# Altium schematic sheet peripheral.SchDoc
size A3; SheetNumber: 2; SheetTotal: 2
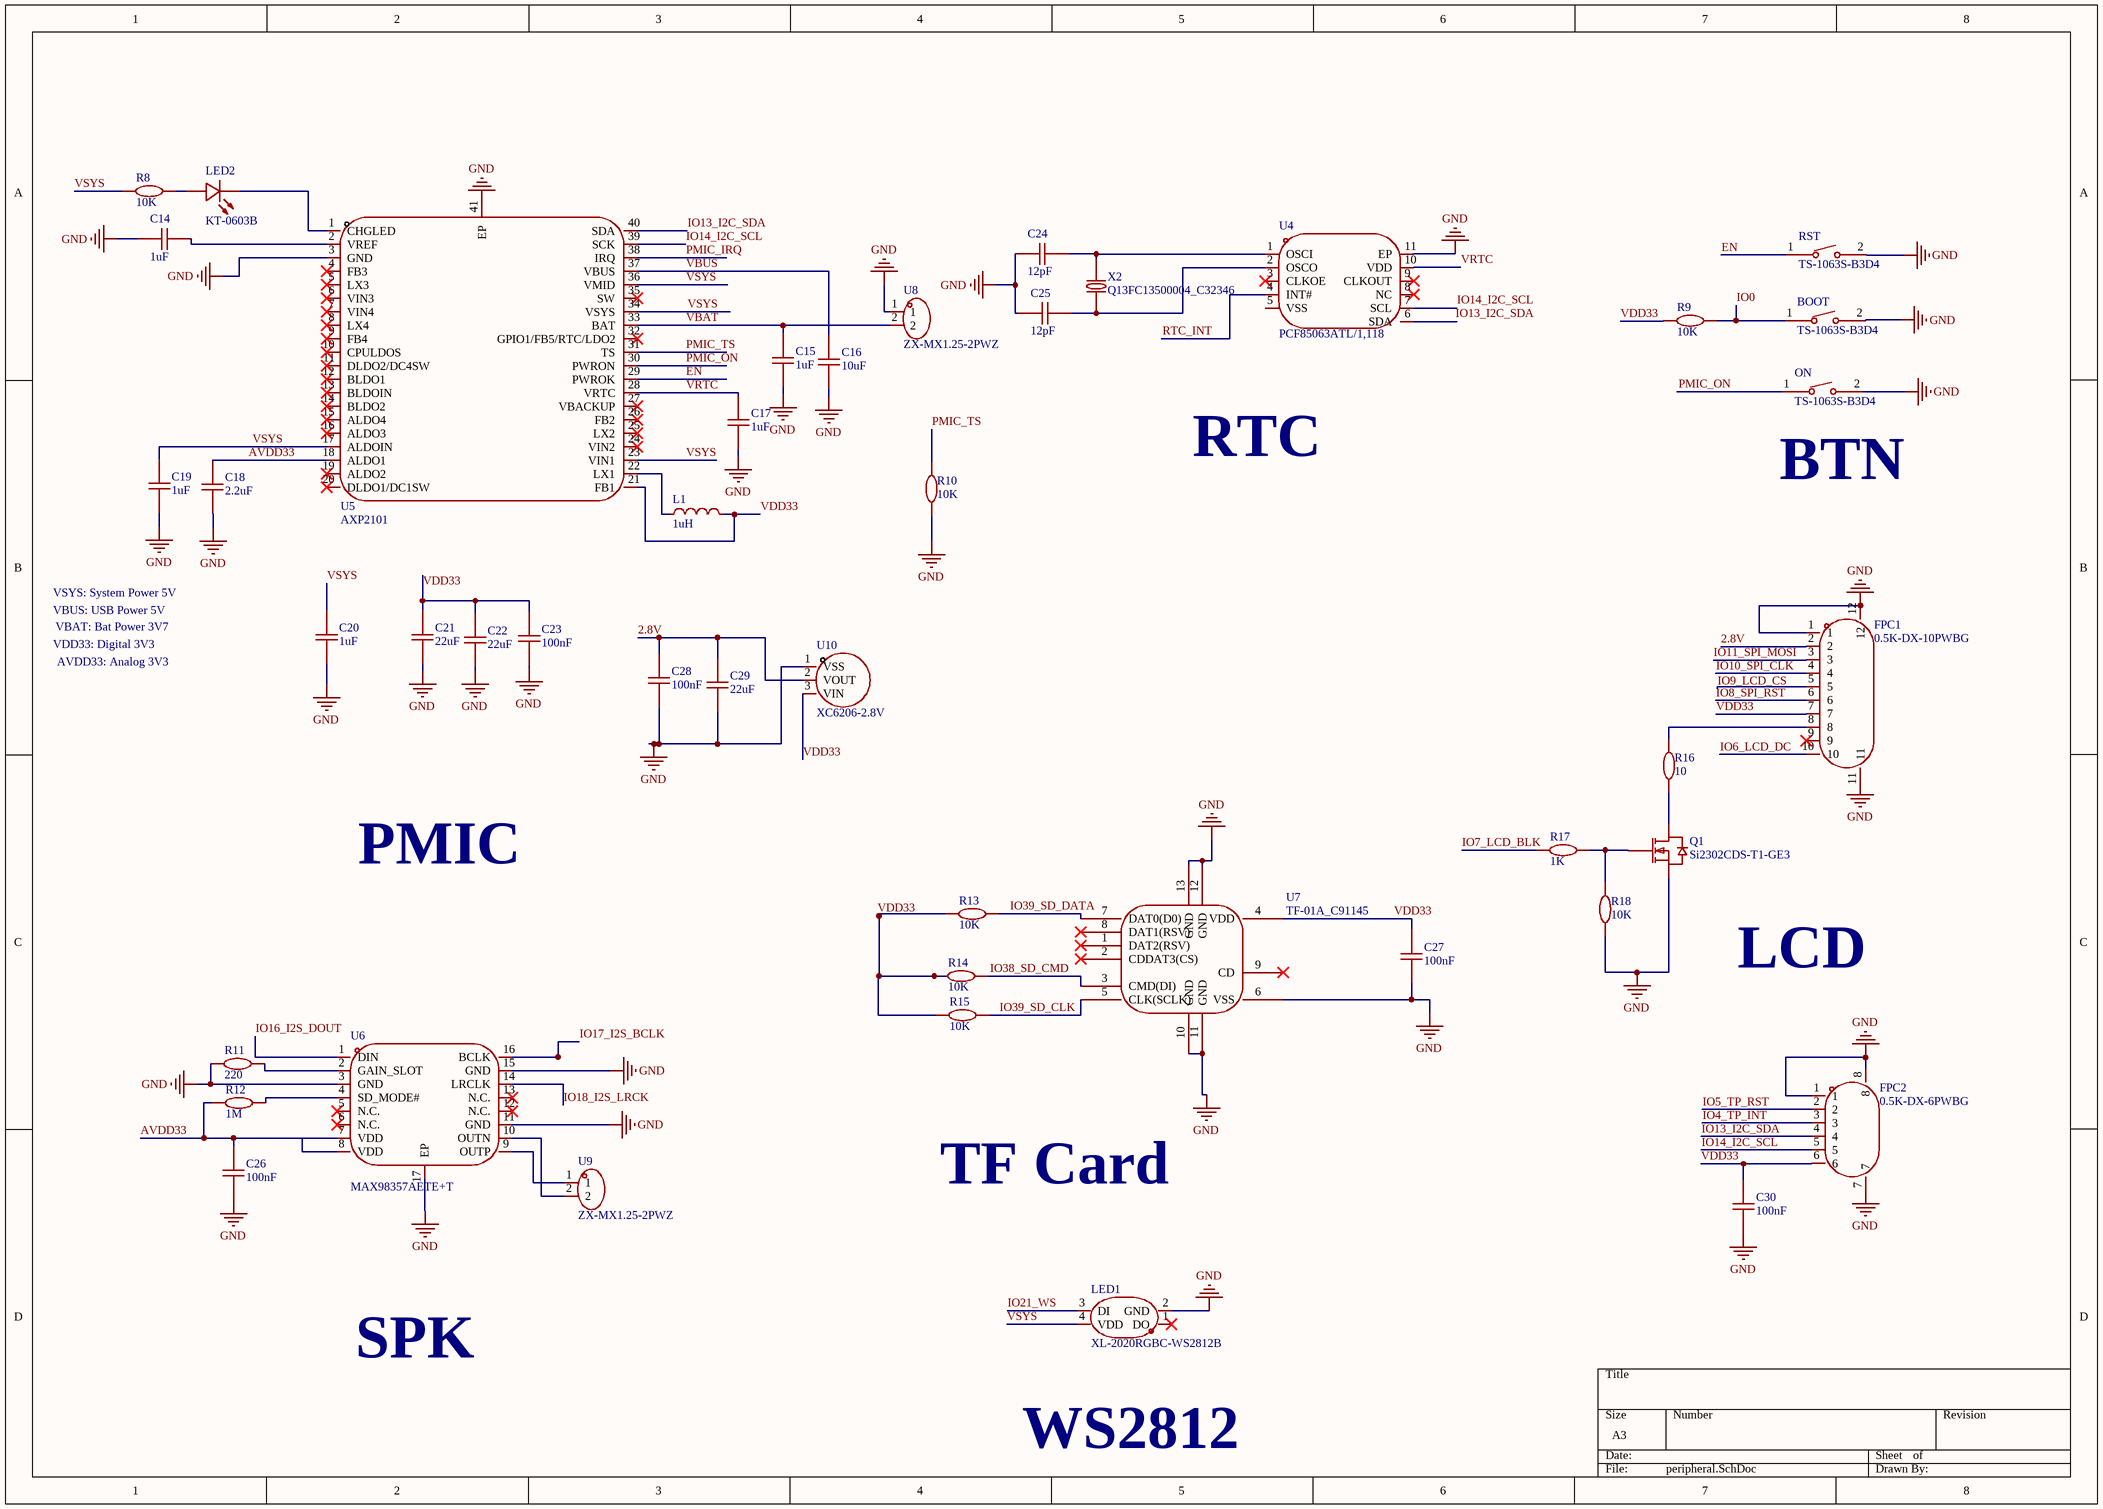
[diagram p0: peripheral.SchDoc]

## Parts
BOOT  TS-1063S-B3D4  [KEY-SMD_L3.0-W2.5-LS4.0_TS-1603S]
C14  1uF  [C0402]
C15  1uF  [C0402]
C16  10uF  [C0603]
C17  1uF  [C0402]
C18  2.2uF  [C0402]
C19  1uF  [C0402]
C20  1uF  [C0402]
C21  22uF  [C0603]
C22  22uF  [C0603]
C23  100nF  [C0402]
C24  12pF  [C0402]
C25  12pF  [C0402]
C26  100nF  [C0402]
C27  100nF  [C0402]
C28  100nF  [C0402]
C29  22uF  [C0603]
C30  100nF  [C0402]
FPC1  0.5K-DX-10PWBG  [FPC-SMD_10P-P0.50_HDGC_0.5K-DX-10PWBG]
FPC2  0.5K-DX-6PWBG  [FPC-SMD_6P-P0.50_DEALON_0.5K-DX-6PWB]
L1  1uH  [L0402-SMD]
LED1  XL-2020RGBC-WS2812B  [LED-SMD_4P-L2.0-W2.0-BR-1]
LED2  KT-0603B  [LED0603-BL]
ON  TS-1063S-B3D4  [KEY-SMD_L3.0-W2.5-LS4.0_TS-1603S]
Q1  Si2302CDS-T1-GE3  [SOT-23_L2.9-W1.3-P1.90-LS2.4-BR]
R8  10K  [R0402]
R9  10K  [R0402]
R10  10K  [R0402]
R11  220  [R0402]
R12  1M  [R0402]
R13  10K  [R0402]
R14  10K  [R0402]
R15  10K  [R0402]
R16  10  [R0402]
R17  1K  [R0402]
R18  10K  [R0402]
RST  TS-1063S-B3D4  [KEY-SMD_L3.0-W2.5-LS4.0_TS-1603S]
U4  PCF85063ATL/1,118  [DFN-10_L2.6-W2.6-P0.50-BL-EP]
U5  AXP2101  [QFN-40_L5.0-W5.0-P0.40-TL-EP3.4]
U6  MAX98357AETE+T  [TQFN-16_L3.0-W3.0-P0.50-BL-EP1.5]
U7  TF-01A_C91145  [TF-SMD_TF-01A]
U8  ZX-MX1.25-2PWZ  [CONN-TH_2P-P1.25_ZX-MX1.25-2PWZ]
U9  ZX-MX1.25-2PWZ  [CONN-TH_2P-P1.25_ZX-MX1.25-2PWZ]
U10  XC6206-2.8V  [SOT-23-3_L2.9-W1.6-P1.90-LS2.8-BR]
X2  Q13FC13500004_C32346  [FC-135R_L3.2-W1.5]

## Nets
GND: BOOT.2 C14.1 C15.1 C16.1 C17.1 C18.1 C19.1 C20.1 C21.1 C22.1 C23.1 C24.1 C25.1 C26.1 C27.1 C28.1 C29.1 C30.1 FPC1.1 FPC1.11 FPC1.12 FPC2.1 FPC2.7 FPC2.8 LED1.2(GND) ON.2 Q1.2(S) R10.1 R11.1 R18.2 RST.2 U4.11(EP) U5.3(GND) U5.41(EP) U6.3(GND) U6.11(GND) U6.15(GND) U6.17(EP) U7.6(VSS) U7.10(GND) U7.11(GND) U7.12(GND) U7.13(GND) U8.1 U10.1(VSS)
2.8V: C28.2 C29.2 FPC1.2 U10.2(VOUT)
AVDD33: C18.2 C26.2 R12.1 U5.18(ALDO1) U6.7(VDD) U6.8(VDD)
EN: RST.1 U5.29(PWROK)
IO0: BOOT.1 R9.2
IO4_TP_INT: FPC2.3
IO5_TP_RST: FPC2.2
IO6_LCD_DC: FPC1.10
IO7_LCD_BLK: R17.2
IO8_SPI_RST: FPC1.6
IO9_LCD_CS: FPC1.5
IO10_SPI_CLK: FPC1.4
IO11_SPI_MOSI: FPC1.3
IO13_I2C_SDA: FPC2.4 U4.6(SDA) U5.40(SDA)
IO14_I2C_SCL: FPC2.5 U4.7(SCL) U5.39(SCK)
IO16_I2S_DOUT: U6.1(DIN)
IO17_I2S_BCLK: U6.16(BCLK)
IO18_I2S_LRCK: U6.14(LRCLK)
IO21_WS: LED1.3(DI)
IO38_SD_CMD: R14.2 U7.3(CMD(DI))
IO39_SD_CLK: R15.2 U7.5(CLK(SCLK))
IO39_SD_DATA: R13.2 U7.7(DAT0(D0))
PMIC_IRQ: U5.38(IRQ)
PMIC_ON: ON.1 U5.30(PWRON)
PMIC_TS: R10.2 U5.31(TS)
RTC_INT: U4.4(INT#)
VBAT: C15.2 U5.33(BAT) U8.2
VBUS: C16.2 U5.37(VBUS)
VDD33: C21.2 C22.2 C23.2 C27.2 C30.2 FPC1.7 FPC2.6 L1.2 R9.1 R13.1 R14.1 R15.1 U5.21(FB1) U7.4(VDD) U10.3(VIN)
VRTC: C17.2 U4.10(VDD) U5.28(VRTC)
VSYS: C19.2 C20.2 LED1.4(VDD) R8.1 U5.17(ALDOIN) U5.23(VIN1) U5.34(VSYS) U5.36(VMID)
NetC14_2: C14.2 U5.2(VREF)
NetC24_2: C24.2 U4.1(OSCI) X2.2
NetC25_2: C25.2 U4.2(OSCO) X2.1
NetFPC1_8: FPC1.8 R16.2
NetL1_1: L1.1 U5.22(LX1)
NetLED2_1: LED2.1(K) U5.1(CHGLED)
NetLED2_2: LED2.2(A) R8.2
NetQ1_1: Q1.1(G) R17.1 R18.1
NetQ1_3: Q1.3(D) R16.1
NetR11_2: R11.2 U6.2(GAIN_SLOT)
NetR12_2: R12.2 U6.4(SD_MODE#)
NetU6_9: U6.9(OUTP) U9.1
NetU6_10: U6.10(OUTN) U9.2

Not connected (* = marked no-connect by the designer): FPC1 9*; LED1 1(DO)*; U4 3(CLKOE)* 5(VSS) 8(NC)* 9(CLKOUT)*; U5 4(FB3)* 5(LX3)* 6(VIN3)* 7(VIN4)* 8(LX4)* 9(FB4)* 10(CPULDOS)* 11(DLDO2/DC4SW)* 12(BLDO1)* 13(BLDOIN)* 14(BLDO2)* 15(ALDO4)* 16(ALDO3)* 19(ALDO2)* 20(DLDO1/DC1SW)* 24(VIN2)* 25(LX2)* 26(FB2)* 27(VBACKUP)* 32(GPIO1/FB5/RTC/LDO2)* 35(SW)*; U6 5(N.C.)* 6(N.C.)* 12(N.C.)* 13(N.C.)*; U7 1(DAT2(RSV))* 2(CDDAT3(CS))* 8(DAT1(RSV))* 9(CD)*

## Notes on the sheet
- RTC
- (near ON) BTN
- VSYS: System Power 5V
- VDD33: Digital 3V3
- VBUS: USB Power 5V
- VBAT: Bat Power 3V7
- AVDD33: Analog 3V3
- PMIC
- LCD
- TF Card
- SPK
- WS2812

## Library data of the parts
C14 C15 C17-C20 C23-C28 C30 = C0402
C16 C21 C22 C29 = C0603
L1 = L0402-SMD
R8-R18 = R0402